# Altium schematic sheet led.SchDoc
size A4
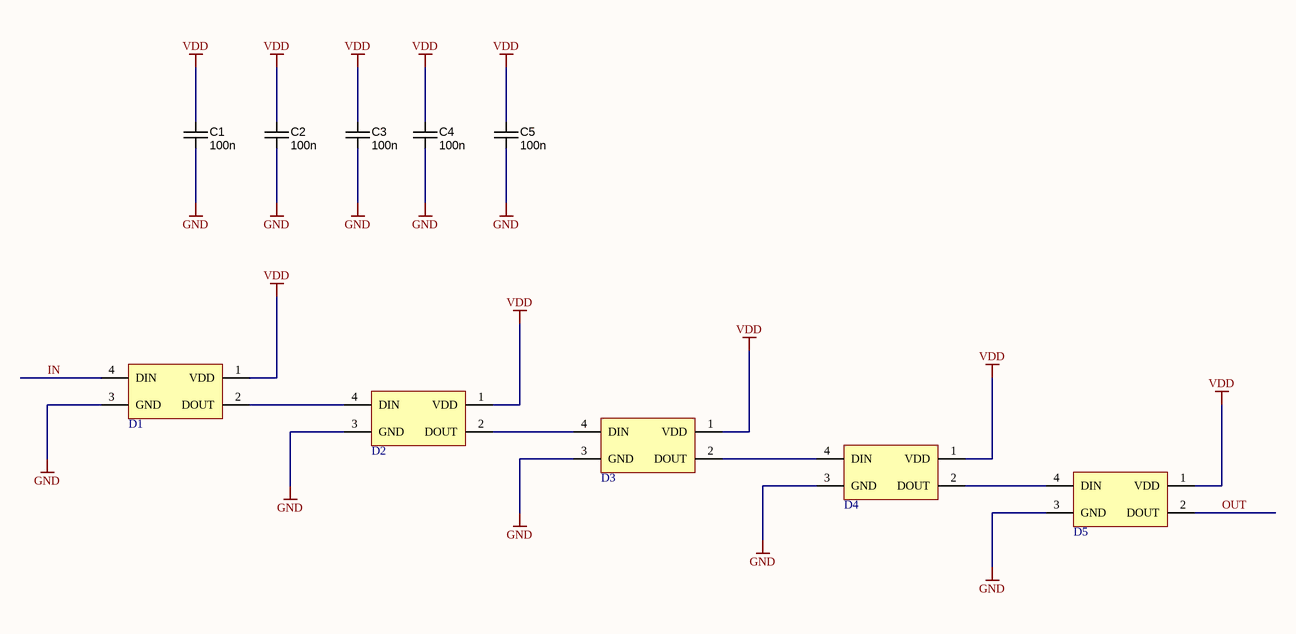
[diagram p0: led.SchDoc]

## Parts
C1  value 100n  [CAPC1608X90N]  (hidden comment: approved sub OK)
C2  value 100n  [CAPC1608X90N]  (hidden comment: approved sub OK)
C3  value 100n  [CAPC1608X90N]  (hidden comment: approved sub OK)
C4  value 100n  [CAPC1608X90N]  (hidden comment: approved sub OK)
C5  value 100n  [CAPC1608X90N]  (hidden comment: approved sub OK)
D1  LED_5050_WS2812B  [LED_5050_WS2812B]  (value not drawn)
D2  LED_5050_WS2812B  [LED_5050_WS2812B]  (value not drawn)
D3  LED_5050_WS2812B  [LED_5050_WS2812B]  (value not drawn)
D4  LED_5050_WS2812B  [LED_5050_WS2812B]  (value not drawn)
D5  LED_5050_WS2812B  [LED_5050_WS2812B]  (value not drawn)

## Nets
GND: C1.2 C2.2 C3.2 C4.2 C5.2 D1.3(GND) D2.3(GND) D3.3(GND) D4.3(GND) D5.3(GND)
VDD: C1.1 C2.1 C3.1 C4.1 C5.1 D1.1(VDD) D2.1(VDD) D3.1(VDD) D4.1(VDD) D5.1(VDD)
IN: D1.4(DIN)
OUT: D5.2(DOUT)
NetD1_2: D1.2(DOUT) D2.4(DIN)
NetD2_2: D2.2(DOUT) D3.4(DIN)
NetD3_2: D3.2(DOUT) D4.4(DIN)
NetD4_2: D4.2(DOUT) D5.4(DIN)

## Library data of the parts
C1-C5 = CAPC_100n_0603_X7R_50V_10%: Capacitor SMD Cer 100nF 10% 50V X7R 0603; Manufacturer 1: AVX Corporation; Manufacturer Part Number 1: 06035C104KAT2A; Ratings: 50V; X7R; Material: ceramic; SCDType: spec; Manufacturer 2: TDK Corporation; Manufacturer Part Number 2: C1608X7R1H104K; Package / Case: 0603 (1608 Metric); Tolerance: ±10%; Supplier 1: Digi-Key; Supplier Part Number 1: 478-5052-1-ND; ComponentLink1URL: http://www.avx.com/docs/Catalogs/cx7r.pdf; ComponentLink1Description: http://www.avx.com/docs/Catalogs/cx7r.pdf; Supplier 2: Digi-Key; Supplier Part Number 2: 445-1314-1-ND; ComponentLink2URL: http://product.tdk.com/capacitor/mlcc/en/documents/mlcc_commercial_general_en.pdf; ComponentLink2Description: http://product.tdk.com/capacitor/mlcc/en/documents/mlcc_commercial_general_en.pdf
D1-D5 = LED_5050_WS2812B: LED